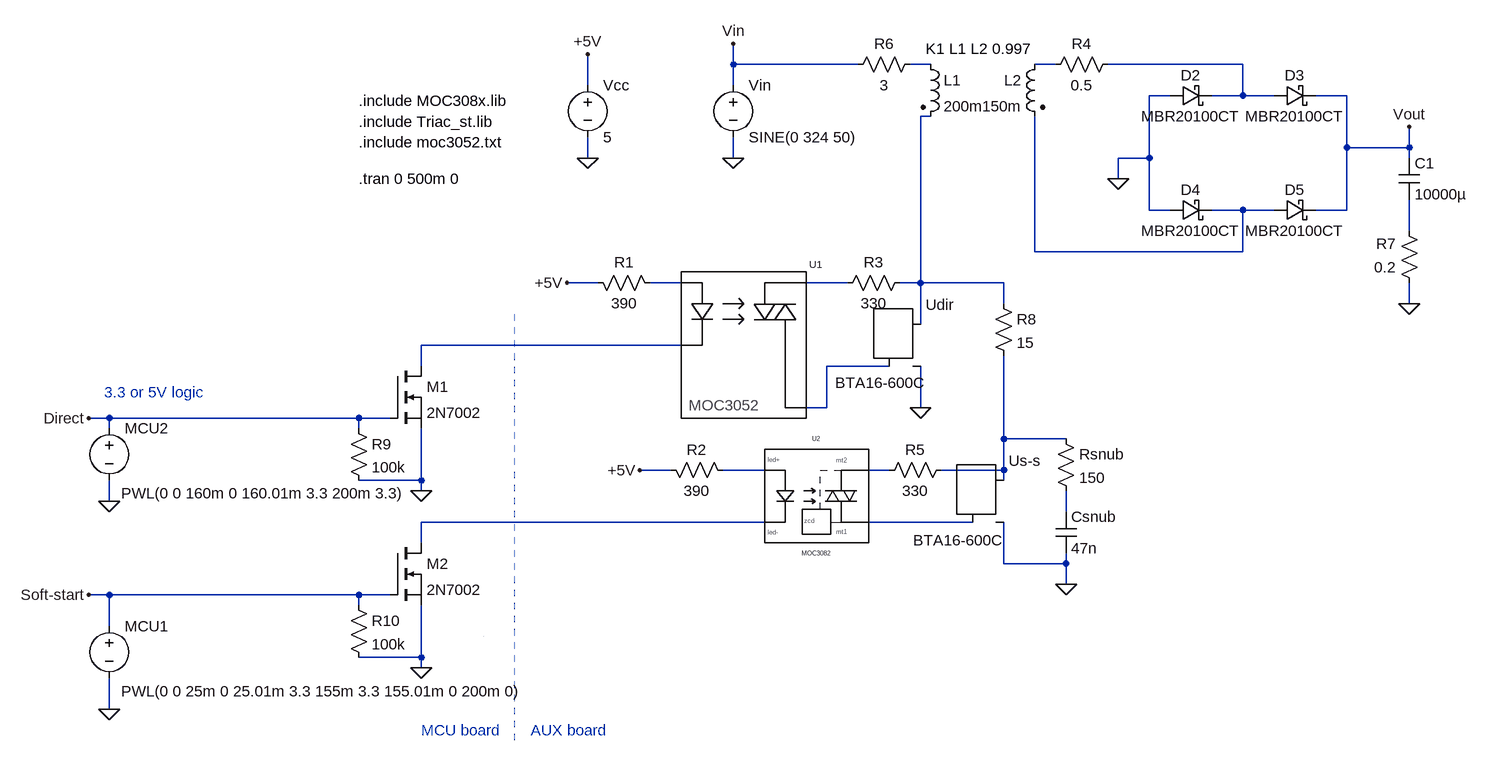
[diagram p0: schematic Soft-start (Macola) v3a.asc]
Soft-start (Macola) v3a.asc, the LTspice schematic file:
Version 4
SHEET 1 980 680
WIRE -512 -976 -512 -1008
WIRE -320 -976 -512 -976
WIRE -208 -976 -240 -976
WIRE -16 -976 -48 -976
WIRE 272 -976 64 -976
WIRE -736 -944 -736 -992
WIRE -512 -944 -512 -976
WIRE 160 -928 128 -928
WIRE 272 -928 272 -976
WIRE 272 -928 224 -928
WIRE 320 -928 272 -928
WIRE 432 -928 384 -928
WIRE -208 -896 -224 -896
WIRE 432 -848 432 -928
WIRE 528 -848 528 -880
WIRE 528 -848 432 -848
WIRE -736 -832 -736 -864
WIRE -512 -832 -512 -864
WIRE 128 -832 128 -928
WIRE 128 -832 80 -832
WIRE 528 -832 528 -848
WIRE 80 -800 80 -832
WIRE 128 -752 128 -832
WIRE 160 -752 128 -752
WIRE 272 -752 224 -752
WIRE 320 -752 272 -752
WIRE 432 -752 432 -848
WIRE 432 -752 384 -752
WIRE 528 -720 528 -768
WIRE -48 -688 -48 -896
WIRE 272 -688 272 -752
WIRE 272 -688 -48 -688
WIRE -720 -640 -768 -640
WIRE -592 -640 -640 -640
WIRE -336 -640 -400 -640
WIRE -224 -640 -224 -896
WIRE -224 -640 -256 -640
WIRE -96 -640 -224 -640
WIRE -96 -608 -96 -640
WIRE 528 -608 528 -640
WIRE -224 -576 -224 -640
WIRE -592 -544 -992 -544
WIRE -992 -512 -992 -544
WIRE -272 -512 -368 -512
WIRE -368 -448 -368 -512
WIRE -368 -448 -400 -448
WIRE -224 -448 -224 -512
WIRE -1472 -432 -1504 -432
WIRE -1088 -432 -1472 -432
WIRE -1040 -432 -1088 -432
WIRE -1472 -416 -1472 -432
WIRE -1088 -416 -1088 -432
WIRE -96 -400 -96 -528
WIRE 0 -400 -96 -400
WIRE -608 -352 -656 -352
WIRE -464 -352 -528 -352
WIRE -272 -352 -304 -352
WIRE -96 -352 -96 -400
WIRE -96 -352 -192 -352
WIRE -992 -336 -992 -416
WIRE -992 -336 -1088 -336
WIRE -96 -336 -96 -352
WIRE -992 -320 -992 -336
WIRE -1472 -304 -1472 -336
WIRE 0 -288 0 -320
WIRE -464 -272 -992 -272
WIRE -144 -272 -304 -272
WIRE -992 -240 -992 -272
WIRE -96 -208 -96 -272
WIRE 0 -208 0 -224
WIRE 0 -208 -96 -208
WIRE 0 -176 0 -208
WIRE -1472 -160 -1504 -160
WIRE -1088 -160 -1472 -160
WIRE -1040 -160 -1088 -160
WIRE -1088 -144 -1088 -160
WIRE -1472 -112 -1472 -160
WIRE -992 -64 -992 -144
WIRE -992 -64 -1088 -64
WIRE -992 -48 -992 -64
WIRE -1472 16 -1472 -32
FLAG -1472 16 0
FLAG -512 -832 0
FLAG -1472 -304 0
FLAG -1504 -160 Soft-start
FLAG -1504 -432 Direct
FLAG 80 -800 0
FLAG 528 -608 0
FLAG 0 -176 0
FLAG 528 -880 Vout
FLAG -512 -1008 Vin
FLAG -736 -992 +5V
FLAG -768 -640 +5V
FLAG -736 -832 0
FLAG -992 -320 0
FLAG -992 -48 0
FLAG -656 -352 +5V
FLAG -224 -448 0
SYMBOL MOC3052 -496 -544 R0
SYMATTR InstName U1
SYMBOL voltage -512 -960 R0
WINDOW 123 0 0 Left 2
WINDOW 39 0 0 Left 2
SYMATTR InstName Vin
SYMATTR Value SINE(0 324 50)
SYMBOL voltage -1472 -128 R0
WINDOW 3 18 116 Left 2
WINDOW 123 0 0 Left 2
WINDOW 39 0 0 Left 2
SYMATTR Value PWL(0 0 25m 0 25.01m 3.3 155m 3.3 155.01m 0 200m 0)
SYMATTR InstName MCU1
SYMBOL res -736 -656 M90
WINDOW 0 0 56 VBottom 2
WINDOW 3 32 56 VTop 2
SYMATTR InstName R1
SYMATTR Value 390
SYMBOL Misc\\TRIAC -256 -576 R0
WINDOW 3 -99 90 Left 2
SYMATTR InstName Udir
SYMATTR Value BTA16-600C
SYMATTR Value2 BTB06-800B
SYMATTR SpiceModel BTB06-800B
SYMBOL res -240 -656 R90
WINDOW 0 0 56 VBottom 2
WINDOW 3 32 56 VTop 2
SYMATTR InstName R3
SYMATTR Value 330
SYMATTR SpiceLine pwr=2
SYMBOL voltage -1472 -432 R0
WINDOW 3 18 116 Left 2
WINDOW 123 0 0 Left 2
WINDOW 39 0 0 Left 2
SYMATTR Value PWL(0 0 160m 0 160.01m 3.3 200m 3.3)
SYMATTR InstName MCU2
SYMBOL res -624 -368 M90
WINDOW 0 0 56 VBottom 2
WINDOW 3 32 56 VTop 2
SYMATTR InstName R2
SYMATTR Value 390
SYMBOL LED_TRIAC_ZCS -416 -336 R0
SYMATTR SpiceModel MOC3082
SYMATTR InstName U2
SYMBOL Misc\\TRIAC -128 -336 R0
WINDOW 3 -107 92 Left 2
SYMATTR InstName Us-s
SYMATTR Value BTA16-600C
SYMATTR Value2 BTB06-800B
SYMATTR SpiceModel BTB06-800B
SYMBOL res -176 -368 R90
WINDOW 0 0 56 VBottom 2
WINDOW 3 32 56 VTop 2
SYMATTR InstName R5
SYMATTR Value 330
SYMATTR SpiceLine pwr=2
SYMBOL res -112 -624 R0
SYMATTR InstName R8
SYMATTR Value 15
SYMATTR SpiceLine pwr=10
SYMBOL schottky 160 -944 M90
WINDOW 0 0 32 VBottom 2
WINDOW 3 32 32 VTop 2
SYMATTR InstName D2
SYMATTR Value MBR20100CT
SYMATTR Description Diode
SYMATTR Type diode
SYMBOL schottky 320 -944 M90
WINDOW 0 0 32 VBottom 2
WINDOW 3 32 32 VTop 2
SYMATTR InstName D3
SYMATTR Value MBR20100CT
SYMATTR Description Diode
SYMATTR Type diode
SYMBOL schottky 160 -768 M90
WINDOW 0 0 32 VBottom 2
WINDOW 3 32 32 VTop 2
SYMATTR InstName D4
SYMATTR Value MBR20100CT
SYMATTR Description Diode
SYMATTR Type diode
SYMBOL schottky 320 -768 M90
WINDOW 0 0 32 VBottom 2
WINDOW 3 32 32 VTop 2
SYMATTR InstName D5
SYMATTR Value MBR20100CT
SYMATTR Description Diode
SYMATTR Type diode
SYMBOL ind2 -224 -992 R0
SYMATTR InstName L1
SYMATTR Value 200m
SYMATTR Type ind
SYMBOL ind2 -32 -992 M0
SYMATTR InstName L2
SYMATTR Value 150m
SYMATTR Type ind
SYMBOL res 80 -992 R90
WINDOW 0 0 56 VBottom 2
WINDOW 3 32 56 VTop 2
SYMATTR InstName R4
SYMATTR Value 0.5
SYMBOL res -224 -992 R90
WINDOW 0 0 56 VBottom 2
WINDOW 3 32 56 VTop 2
SYMATTR InstName R6
SYMATTR Value 3
SYMBOL cap 512 -832 R0
SYMATTR InstName C1
SYMATTR Value 10000µ
SYMBOL res 544 -624 R180
WINDOW 0 36 76 Left 2
WINDOW 3 36 40 Left 2
SYMATTR InstName R7
SYMATTR Value 0.2
SYMBOL nmos -1040 -512 R0
SYMATTR InstName M1
SYMATTR Value 2N7002
SYMBOL voltage -736 -960 R0
WINDOW 123 0 0 Left 2
WINDOW 39 0 0 Left 2
SYMATTR InstName Vcc
SYMATTR Value 5
SYMBOL res -1104 -432 R0
SYMATTR InstName R9
SYMATTR Value 100k
SYMBOL nmos -1040 -240 R0
SYMATTR InstName M2
SYMATTR Value 2N7002
SYMBOL res -1104 -160 R0
SYMATTR InstName R10
SYMATTR Value 100k
SYMBOL res -16 -416 R0
SYMATTR InstName Rsnub
SYMATTR Value 150
SYMBOL cap -16 -288 R0
SYMATTR InstName Csnub
SYMATTR Value 47n
TEXT -1088 -800 Left 2 !.tran 0 500m 0
TEXT -1088 -856 Left 2 !.include moc3052.txt
TEXT -1088 -888 Left 2 !.include Triac_st.lib
TEXT -1088 -920 Left 2 !.include MOC308x.lib
TEXT -216 -1000 Left 2 !K1 L1 L2 0.997
TEXT -992 48 Left 2 ;MCU board
TEXT -824 48 Left 2 ;AUX board
TEXT -1480 -472 Left 2 ;3.3 or 5V logic
LINE Normal -848 64 -848 -592 2
LINE Normal -896 -96 -896 -96 2

The netlist it stands for:
* Soft-start (Macola) v3a.asc
XU1 N007 N009 N010 N008 MOC3052
Vin Vin 0 SINE(0 324 50)
V§MCU1 Soft-start 0 PWL(0 0 25m 0 25.01m 3.3 155m 3.3 155.01m 0 200m 0)
R1 +5V N007 390
XUdir N004 N010 0 BTB06-800B BTA16-600C BTB06-800B  ; pins MT2 G MT1
R3 N004 N008 330 pwr=2
V§MCU2 Direct 0 PWL(0 0 160m 0 160.01m 3.3 200m 3.3)
R2 +5V N012 390
XU2 N012 N015 N013 N016 MOC3082  ; pins led+ led- mt2 mt1
XUs-s N011 N016 0 BTB06-800B BTA16-600C BTB06-800B  ; pins MT2 G MT1
R5 N011 N013 330 pwr=2
R8 N004 N011 15 pwr=10
D2 0 N003 MBR20100CT
D3 N003 Vout MBR20100CT
D4 0 N005 MBR20100CT
D5 N005 Vout MBR20100CT
L1 N001 N004 200m
L2 N002 N005 150m
R4 N003 N002 0.5
R6 N001 Vin 3
C1 Vout N006 10000µ
R7 0 N006 0.2
M1 N009 Direct 0 0 2N7002
Vcc +5V 0 5
R9 Direct 0 100k
M2 N015 Soft-start 0 0 2N7002
R10 Soft-start 0 100k
Rsnub N011 N014 150
Csnub N014 0 47n
.model D D
.lib standard.dio
.model NMOS NMOS
.model PMOS PMOS
.lib standard.mos
.tran 0 500m 0
.include moc3052.txt
.include Triac_st.lib
.include MOC308x.lib
K1 L1 L2 0.997
* MCU board
* AUX board
* 3.3 or 5V logic
.lib .\moc3052.txt
.backanno
.end